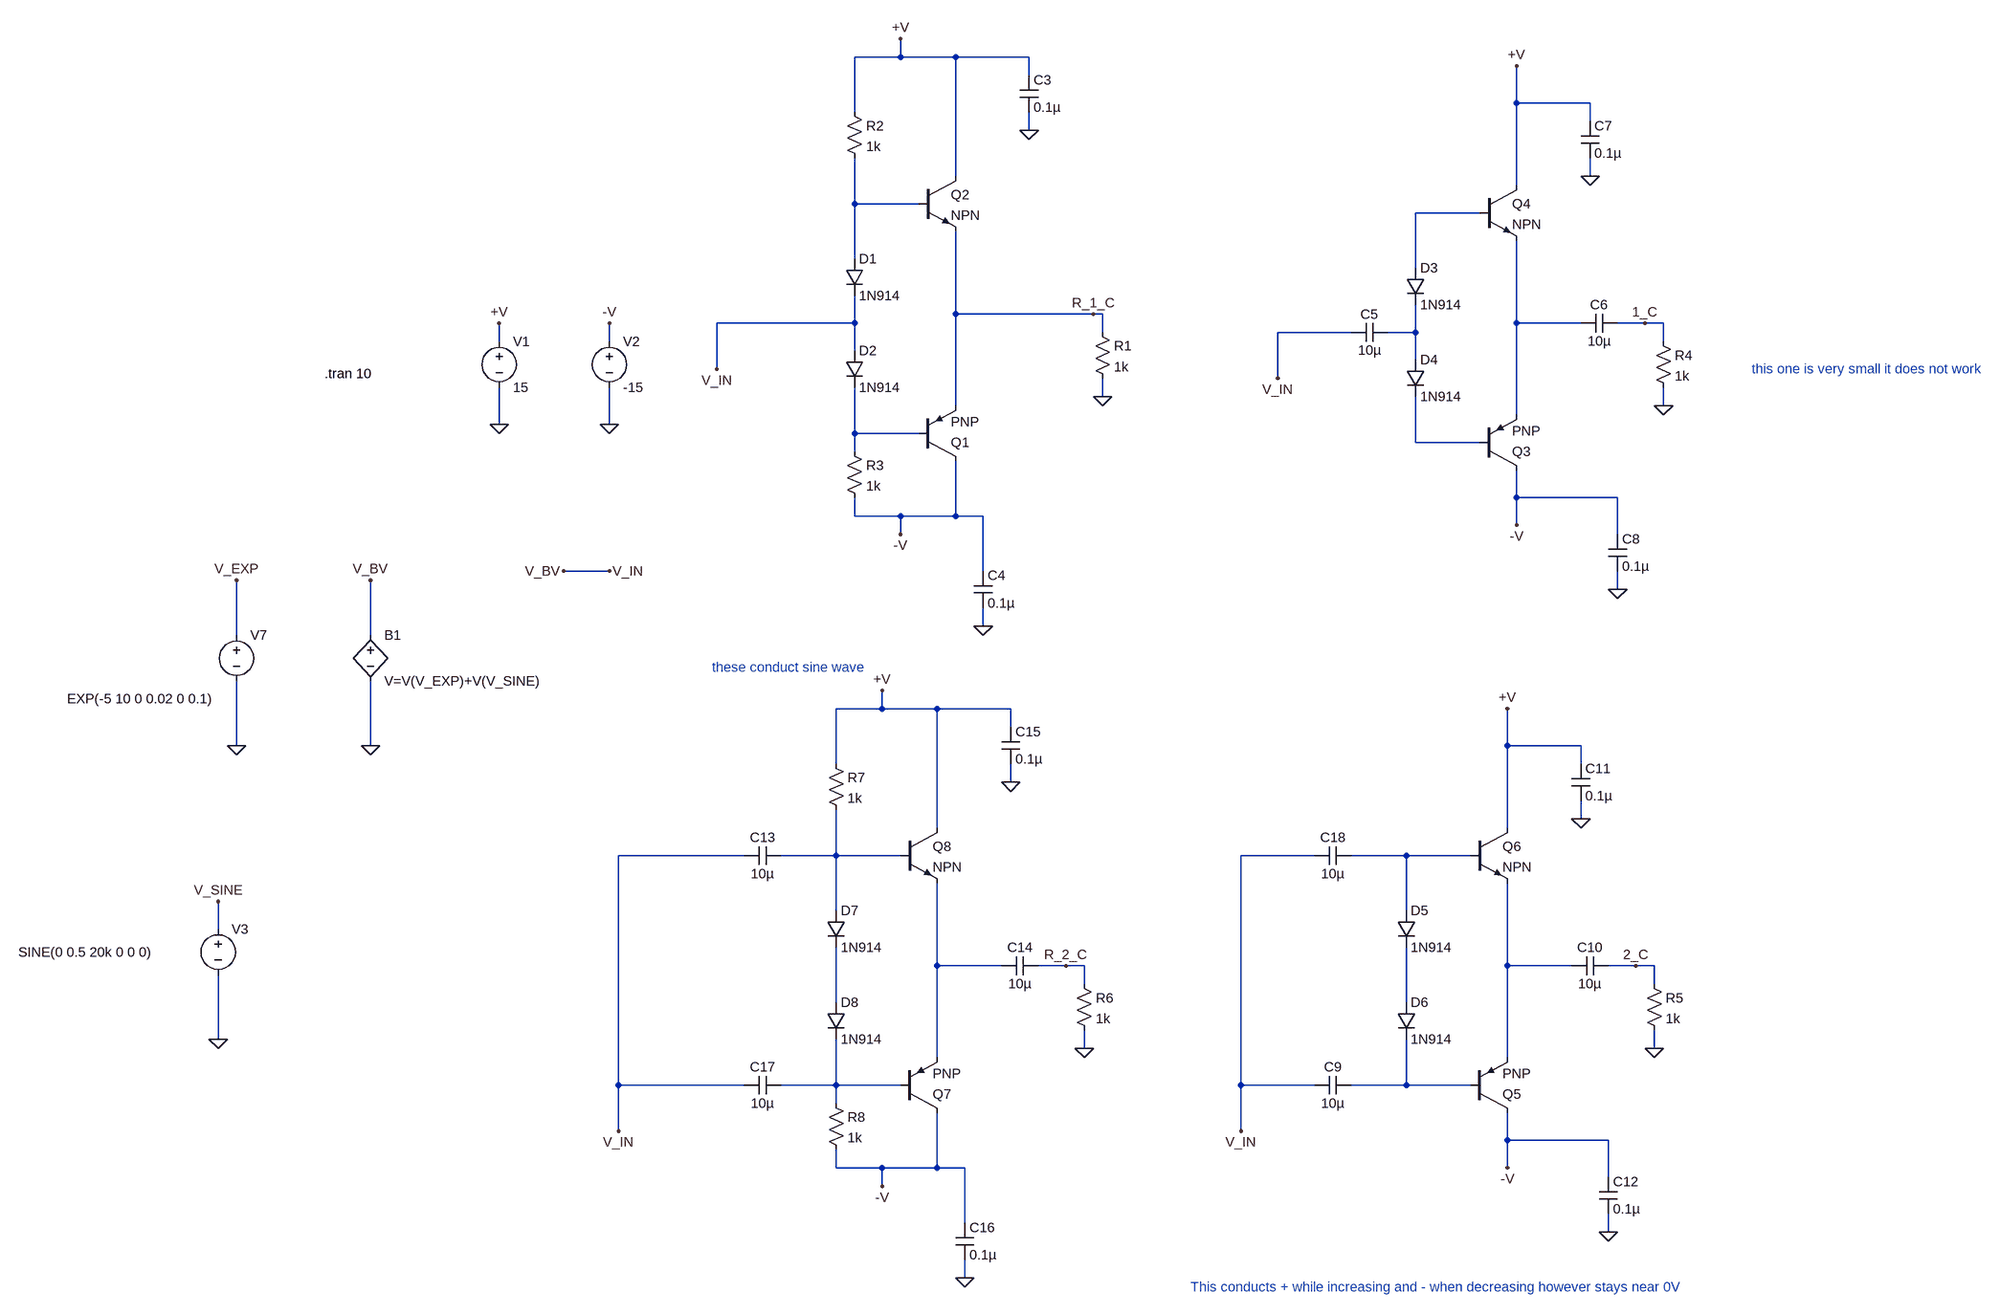
[diagram p0: schematic CLASS_AB.asc]
CLASS_AB.asc, the LTspice schematic file:
Version 4
SHEET 1 2892 1776
WIRE 368 -384 368 -416
WIRE 368 -384 288 -384
WIRE 464 -384 368 -384
WIRE 592 -384 464 -384
WIRE 592 -352 592 -384
WIRE 1696 -304 1696 -368
WIRE 1824 -304 1696 -304
WIRE 288 -288 288 -384
WIRE 1824 -272 1824 -304
WIRE 592 -256 592 -288
WIRE 464 -176 464 -384
WIRE 1824 -176 1824 -208
WIRE 1696 -160 1696 -304
WIRE 288 -128 288 -208
WIRE 400 -128 288 -128
WIRE 1632 -112 1520 -112
WIRE 288 -32 288 -128
WIRE 1520 -16 1520 -112
WIRE 464 64 464 -80
WIRE 704 64 464 64
WIRE 720 64 704 64
WIRE 288 80 288 32
WIRE 288 80 48 80
WIRE 1696 80 1696 -64
WIRE 1808 80 1696 80
WIRE 1920 80 1872 80
WIRE 1952 80 1920 80
WIRE 720 96 720 64
WIRE 1408 96 1280 96
WIRE 1520 96 1520 48
WIRE 1520 96 1472 96
WIRE -336 112 -336 80
WIRE -144 112 -144 80
WIRE 1952 112 1952 80
WIRE 288 128 288 80
WIRE 1520 144 1520 96
WIRE 48 160 48 80
WIRE 1280 176 1280 96
WIRE 720 208 720 176
WIRE 464 224 464 64
WIRE 1952 224 1952 192
WIRE 1696 240 1696 80
WIRE -336 256 -336 192
WIRE -144 256 -144 192
WIRE 288 272 288 192
WIRE 400 272 288 272
WIRE 1520 288 1520 208
WIRE 1632 288 1520 288
WIRE 288 304 288 272
WIRE 1696 384 1696 336
WIRE 1872 384 1696 384
WIRE 288 416 288 384
WIRE 368 416 288 416
WIRE 464 416 464 320
WIRE 464 416 368 416
WIRE 512 416 464 416
WIRE 1696 432 1696 384
WIRE 368 448 368 416
WIRE 1872 448 1872 384
WIRE -144 512 -224 512
WIRE 512 512 512 416
WIRE 1872 544 1872 512
WIRE 512 608 512 576
WIRE -800 624 -800 528
WIRE -560 624 -560 528
WIRE 336 752 336 720
WIRE 336 752 256 752
WIRE 432 752 336 752
WIRE 560 752 432 752
WIRE 560 784 560 752
WIRE -800 816 -800 704
WIRE -560 816 -560 704
WIRE 1680 816 1680 752
WIRE 1808 816 1680 816
WIRE 256 848 256 752
WIRE 1808 848 1808 816
WIRE 560 880 560 848
WIRE 1808 944 1808 912
WIRE 432 960 432 752
WIRE 1680 960 1680 816
WIRE 96 1008 -128 1008
WIRE 256 1008 256 928
WIRE 256 1008 160 1008
WIRE 368 1008 256 1008
WIRE 1344 1008 1216 1008
WIRE 1504 1008 1408 1008
WIRE 1616 1008 1504 1008
WIRE 256 1104 256 1008
WIRE 1504 1104 1504 1008
WIRE -832 1136 -832 1088
WIRE 432 1200 432 1056
WIRE 544 1200 432 1200
WIRE 656 1200 608 1200
WIRE 688 1200 656 1200
WIRE 1680 1200 1680 1056
WIRE 1792 1200 1680 1200
WIRE 1904 1200 1856 1200
WIRE 1936 1200 1904 1200
WIRE 688 1232 688 1200
WIRE 1936 1232 1936 1200
WIRE 256 1264 256 1168
WIRE 1504 1264 1504 1168
WIRE -832 1328 -832 1216
WIRE 688 1344 688 1312
WIRE 1936 1344 1936 1312
WIRE 432 1360 432 1200
WIRE 1680 1360 1680 1200
WIRE -128 1408 -128 1008
WIRE 96 1408 -128 1408
WIRE 256 1408 256 1328
WIRE 256 1408 160 1408
WIRE 368 1408 256 1408
WIRE 1216 1408 1216 1008
WIRE 1344 1408 1216 1408
WIRE 1504 1408 1504 1328
WIRE 1504 1408 1408 1408
WIRE 1616 1408 1504 1408
WIRE 256 1440 256 1408
WIRE -128 1488 -128 1408
WIRE 1216 1488 1216 1408
WIRE 1680 1504 1680 1456
WIRE 1856 1504 1680 1504
WIRE 256 1552 256 1520
WIRE 336 1552 256 1552
WIRE 432 1552 432 1456
WIRE 432 1552 336 1552
WIRE 480 1552 432 1552
WIRE 1680 1552 1680 1504
WIRE 1856 1568 1856 1504
WIRE 336 1584 336 1552
WIRE 480 1648 480 1552
WIRE 1856 1664 1856 1632
WIRE 480 1744 480 1712
FLAG -336 256 0
FLAG -144 256 0
FLAG -336 80 +V
FLAG -144 80 -V
FLAG 368 -416 +V
FLAG 720 208 0
FLAG 592 -256 0
FLAG 512 608 0
FLAG 368 448 -V
FLAG 1696 -368 +V
FLAG 1952 224 0
FLAG 1824 -176 0
FLAG 1872 544 0
FLAG 1696 432 -V
FLAG 1680 752 +V
FLAG 1936 1344 0
FLAG 1808 944 0
FLAG 1856 1664 0
FLAG 1680 1552 -V
FLAG 336 720 +V
FLAG 688 1344 0
FLAG 560 880 0
FLAG 480 1744 0
FLAG 336 1584 -V
FLAG 704 64 R_1_C
FLAG 656 1200 R_2_C
FLAG 1904 1200 2_C
FLAG 1920 80 1_C
FLAG -800 816 0
FLAG -832 1328 0
FLAG -832 1088 V_SINE
FLAG 48 160 V_IN
FLAG -128 1488 V_IN
FLAG 1280 176 V_IN
FLAG 1216 1488 V_IN
FLAG -800 528 V_EXP
FLAG -560 816 0
FLAG -560 528 V_BV
FLAG -144 512 V_IN
FLAG -224 512 V_BV
SYMBOL voltage -336 96 R0
WINDOW 123 0 0 Left 0
WINDOW 39 0 0 Left 0
SYMATTR InstName V1
SYMATTR Value 15
SYMBOL voltage -144 96 R0
WINDOW 123 0 0 Left 0
WINDOW 39 0 0 Left 0
SYMATTR InstName V2
SYMATTR Value -15
SYMBOL pnp 400 320 M180
SYMATTR InstName Q1
SYMBOL npn 400 -176 R0
SYMATTR InstName Q2
SYMBOL res 704 80 R0
SYMATTR InstName R1
SYMATTR Value 1k
SYMBOL diode 272 -32 R0
SYMATTR InstName D1
SYMATTR Value 1N914
SYMBOL diode 272 128 R0
SYMATTR InstName D2
SYMATTR Value 1N914
SYMBOL res 272 -304 R0
SYMATTR InstName R2
SYMATTR Value 1k
SYMBOL res 272 288 R0
SYMATTR InstName R3
SYMATTR Value 1k
SYMBOL cap 576 -352 R0
SYMATTR InstName C3
SYMATTR Value 0.1µ
SYMBOL cap 496 512 R0
SYMATTR InstName C4
SYMATTR Value 0.1µ
SYMBOL voltage -832 1120 R0
WINDOW 3 -348 56 Left 2
WINDOW 123 0 0 Left 0
WINDOW 39 0 0 Left 0
SYMATTR Value SINE(0 0.5 20k 0 0 0)
SYMATTR InstName V3
SYMBOL cap 1472 80 R90
WINDOW 0 0 32 VBottom 2
WINDOW 3 32 32 VTop 2
SYMATTR InstName C5
SYMATTR Value 10µ
SYMBOL pnp 1632 336 M180
SYMATTR InstName Q3
SYMBOL npn 1632 -160 R0
SYMATTR InstName Q4
SYMBOL cap 1872 64 R90
WINDOW 0 0 32 VBottom 2
WINDOW 3 32 32 VTop 2
SYMATTR InstName C6
SYMATTR Value 10µ
SYMBOL res 1936 96 R0
SYMATTR InstName R4
SYMATTR Value 1k
SYMBOL diode 1504 -16 R0
SYMATTR InstName D3
SYMATTR Value 1N914
SYMBOL diode 1504 144 R0
SYMATTR InstName D4
SYMATTR Value 1N914
SYMBOL cap 1808 -272 R0
SYMATTR InstName C7
SYMATTR Value 0.1µ
SYMBOL cap 1856 448 R0
SYMATTR InstName C8
SYMATTR Value 0.1µ
SYMBOL cap 1408 1392 R90
WINDOW 0 0 32 VBottom 2
WINDOW 3 32 32 VTop 2
SYMATTR InstName C9
SYMATTR Value 10µ
SYMBOL pnp 1616 1456 M180
SYMATTR InstName Q5
SYMBOL npn 1616 960 R0
SYMATTR InstName Q6
SYMBOL cap 1856 1184 R90
WINDOW 0 0 32 VBottom 2
WINDOW 3 32 32 VTop 2
SYMATTR InstName C10
SYMATTR Value 10µ
SYMBOL res 1920 1216 R0
SYMATTR InstName R5
SYMATTR Value 1k
SYMBOL diode 1488 1104 R0
SYMATTR InstName D5
SYMATTR Value 1N914
SYMBOL diode 1488 1264 R0
SYMATTR InstName D6
SYMATTR Value 1N914
SYMBOL cap 1792 848 R0
SYMATTR InstName C11
SYMATTR Value 0.1µ
SYMBOL cap 1840 1568 R0
SYMATTR InstName C12
SYMATTR Value 0.1µ
SYMBOL pnp 368 1456 M180
SYMATTR InstName Q7
SYMBOL npn 368 960 R0
SYMATTR InstName Q8
SYMBOL cap 608 1184 R90
WINDOW 0 0 32 VBottom 2
WINDOW 3 32 32 VTop 2
SYMATTR InstName C14
SYMATTR Value 10µ
SYMBOL res 672 1216 R0
SYMATTR InstName R6
SYMATTR Value 1k
SYMBOL diode 240 1104 R0
SYMATTR InstName D7
SYMATTR Value 1N914
SYMBOL diode 240 1264 R0
SYMATTR InstName D8
SYMATTR Value 1N914
SYMBOL res 240 832 R0
SYMATTR InstName R7
SYMATTR Value 1k
SYMBOL res 240 1424 R0
SYMATTR InstName R8
SYMATTR Value 1k
SYMBOL cap 544 784 R0
SYMATTR InstName C15
SYMATTR Value 0.1µ
SYMBOL cap 464 1648 R0
SYMATTR InstName C16
SYMATTR Value 0.1µ
SYMBOL cap 160 992 R90
WINDOW 0 0 32 VBottom 2
WINDOW 3 32 32 VTop 2
SYMATTR InstName C13
SYMATTR Value 10µ
SYMBOL cap 160 1392 R90
WINDOW 0 0 32 VBottom 2
WINDOW 3 32 32 VTop 2
SYMATTR InstName C17
SYMATTR Value 10µ
SYMBOL cap 1408 992 R90
WINDOW 0 0 32 VBottom 2
WINDOW 3 32 32 VTop 2
SYMATTR InstName C18
SYMATTR Value 10µ
SYMBOL voltage -800 608 R0
WINDOW 3 -295 127 Left 2
WINDOW 123 0 0 Left 0
WINDOW 39 0 0 Left 0
SYMATTR Value EXP(-5 10 0 0.02 0 0.1)
SYMATTR InstName V7
SYMBOL bv -560 608 R0
SYMATTR InstName B1
SYMATTR Value V=V(V_EXP)+V(V_SINE)
TEXT -640 168 Left 2 !.tran 10
TEXT 1128 1760 Left 2 ;This conducts + while increasing and - when decreasing however stays near 0V
TEXT 2136 160 Left 2 ;this one is very small it does not work
TEXT 40 680 Left 2 ;these conduct sine wave

The netlist it stands for:
* CLASS_AB.asc
V1 +V 0 15
V2 -V 0 -15
Q1 -V N005 R_1_C 0 PNP
Q2 +V N001 R_1_C 0 NPN
R1 R_1_C 0 1k
D1 N001 V_BV 1N914
D2 V_BV N005 1N914
R2 +V N001 1k
R3 N005 -V 1k
C3 +V 0 0.1µ
C4 -V 0 0.1µ
V3 V_SINE 0 SINE(0 0.5 20k 0 0 0)
C5 N004 V_BV 10µ
Q3 -V N006 N003 0 PNP
Q4 +V N002 N003 0 NPN
C6 1_C N003 10µ
R4 1_C 0 1k
D3 N002 N004 1N914
D4 N004 N006 1N914
C7 +V 0 0.1µ
C8 -V 0 0.1µ
C9 N014 V_BV 10µ
Q5 -V N014 N010 0 PNP
Q6 +V N008 N010 0 NPN
C10 2_C N010 10µ
R5 2_C 0 1k
D5 N008 N012 1N914
D6 N012 N014 1N914
C11 +V 0 0.1µ
C12 -V 0 0.1µ
Q7 -V N013 N009 0 PNP
Q8 +V N007 N009 0 NPN
C14 R_2_C N009 10µ
R6 R_2_C 0 1k
D7 N007 N011 1N914
D8 N011 N013 1N914
R7 +V N007 1k
R8 N013 -V 1k
C15 +V 0 0.1µ
C16 -V 0 0.1µ
C13 N007 V_BV 10µ
C17 N013 V_BV 10µ
C18 N008 V_BV 10µ
V7 V_EXP 0 EXP(-5 10 0 0.02 0 0.1)
B1 V_BV 0 V=V(V_EXP)+V(V_SINE)
.model D D
.lib standard.dio
.model NPN NPN
.model PNP PNP
.lib standard.bjt
.tran 10
* This conducts + while increasing and - when decreasing however stays near 0V
* this one is very small it does not work
* these conduct sine wave
.backanno
.end